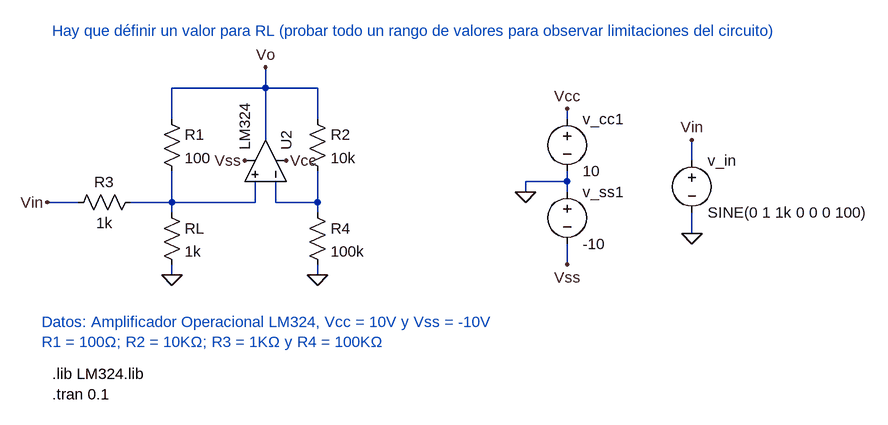
[diagram p0: schematic circuito2lab1.asc]
circuito2lab1.asc, the LTspice schematic file:
Version 4
SHEET 1 1172 680
WIRE 224 -16 224 -48
WIRE 224 -16 80 -16
WIRE 304 -16 224 -16
WIRE 80 32 80 -16
WIRE 304 32 304 -16
WIRE 688 32 688 16
WIRE 224 64 224 -16
WIRE 880 96 880 64
WIRE 688 128 688 112
WIRE 688 128 624 128
WIRE 624 144 624 128
WIRE 688 144 688 128
WIRE -64 160 -112 160
WIRE 80 160 80 112
WIRE 80 160 16 160
WIRE 208 160 208 128
WIRE 208 160 80 160
WIRE 240 160 240 128
WIRE 304 160 304 112
WIRE 304 160 240 160
WIRE 80 176 80 160
WIRE 304 176 304 160
WIRE 880 208 880 176
WIRE 688 256 688 224
WIRE 80 272 80 256
WIRE 304 272 304 256
FLAG 224 -48 Vo
FLAG -112 160 Vin
FLAG 80 272 0
FLAG 304 272 0
FLAG 624 144 0
FLAG 688 16 Vcc
FLAG 688 256 Vss
FLAG 880 208 0
FLAG 880 64 Vin
FLAG 256 96 Vcc
FLAG 192 96 Vss
SYMBOL res 64 160 R0
SYMATTR InstName RL
SYMATTR Value 1k
SYMBOL res 288 160 R0
SYMATTR InstName R4
SYMATTR Value 100k
SYMBOL res 288 16 R0
SYMATTR InstName R2
SYMATTR Value 10k
SYMBOL res 64 16 R0
SYMATTR InstName R1
SYMATTR Value 100
SYMBOL res 32 144 R90
WINDOW 0 0 56 VBottom 2
WINDOW 3 32 56 VTop 2
SYMATTR InstName R3
SYMATTR Value 1k
SYMBOL voltage 688 16 R0
WINDOW 123 0 0 Left 0
WINDOW 39 0 0 Left 0
SYMATTR InstName v_cc1
SYMATTR Value 10
SYMBOL voltage 688 128 R0
WINDOW 123 0 0 Left 0
WINDOW 39 0 0 Left 0
SYMATTR InstName v_ss1
SYMATTR Value -10
SYMBOL voltage 880 80 R0
WINDOW 123 0 0 Left 0
WINDOW 39 0 0 Left 0
SYMATTR InstName v_in
SYMATTR Value SINE(0 1 1k 0 0 0 100)
SYMBOL OpAmps\\opamp2 288 96 M270
SYMATTR InstName U2
SYMATTR Value LM324
TEXT -120 344 Left 2 ;Datos: Amplificador Operacional LM324, Vcc = 10V y Vss = -10V\nR1 = 100Ω; R2 = 10KΩ; R3 = 1KΩ y R4 = 100KΩ
TEXT -104 -104 Left 2 ;Hay que définir un valor para RL (probar todo un rango de valores para observar limitaciones del circuito)
TEXT -104 424 Left 2 !.lib LM324.lib
TEXT -104 456 Left 2 !.tran 0.1

The netlist it stands for:
* circuito2lab1.asc
RL N001 0 1k
R4 N002 0 100k
R2 Vo N002 10k
R1 Vo N001 100
R3 N001 Vin 1k
v_cc1 Vcc 0 10
v_ss1 0 Vss -10
v_in Vin 0 SINE(0 1 1k 0 0 0 100)
XU2 N001 N002 Vcc Vss Vo LM324  ; pins In+ In- V+ V- OUT
* Datos: Amplificador Operacional LM324, Vcc = 10V y Vss = -10V
* R1 = 100Ω; R2 = 10KΩ; R3 = 1KΩ y R4 = 100KΩ
* Hay que définir un valor para RL (probar todo un rango de valores para observar limitaciones del circuito)
.lib LM324.lib
.tran 0.1
.backanno
.end